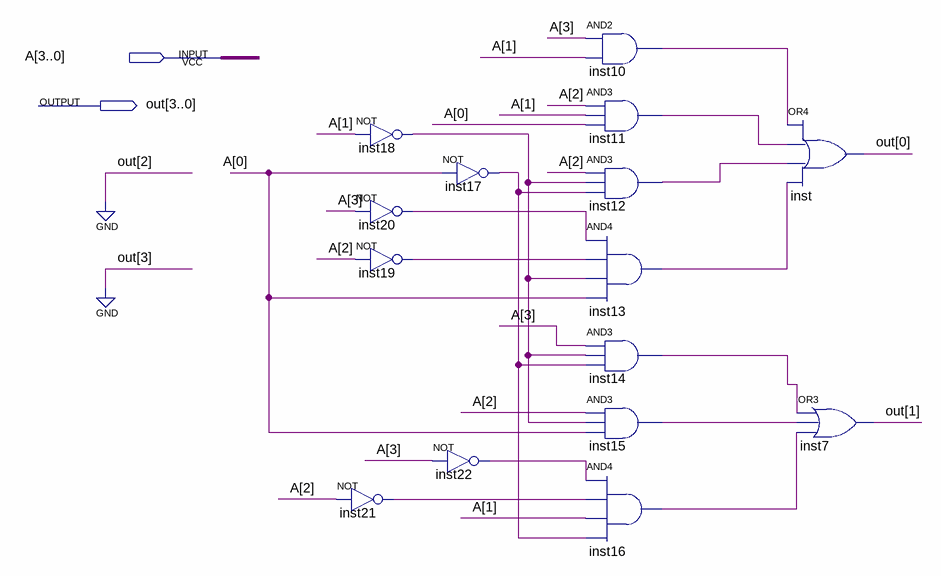
[diagram p0: schematic sheet]
// Quartus schematic 4Bit-mod3.bdf as structural Verilog: 15 symbols, 2 pins
module \4Bit-mod3  (
  input  [3:0] A,
  output [3:0] out
);

  wire inst10_out, inst11_out, inst12_out, inst13_out, inst14_out, inst15_out, inst16_out, inst17_out,
       inst18_out, inst19_out, inst20_out, inst21_out, inst22_out;

  not inst18 (inst18_out, A[1]);
  not inst20 (inst20_out, A[3]);
  not inst19 (inst19_out, A[2]);
  not inst21 (inst21_out, A[2]);
  not inst22 (inst22_out, A[3]);
  not inst17 (inst17_out, A[0]);
  and inst10 (inst10_out, A[3], A[1]);
  and inst11 (inst11_out, A[2], A[1], A[0]);
  and inst12 (inst12_out, A[2], inst18_out, inst17_out);
  and inst13 (inst13_out, inst20_out, inst19_out, inst18_out, A[0]);
  and inst14 (inst14_out, A[3], inst18_out, inst17_out);
  and inst15 (inst15_out, A[2], inst18_out, A[0]);
  and inst16 (inst16_out, inst22_out, inst21_out, A[1], inst17_out);
  or inst (out[0], inst10_out, inst11_out, inst12_out, inst13_out);
  or inst7 (out[1], inst14_out, inst15_out, inst16_out);

  assign out[3:2] = 2'b00;
endmodule
